# Altium project BSM-3_next_generation.PrjPcb
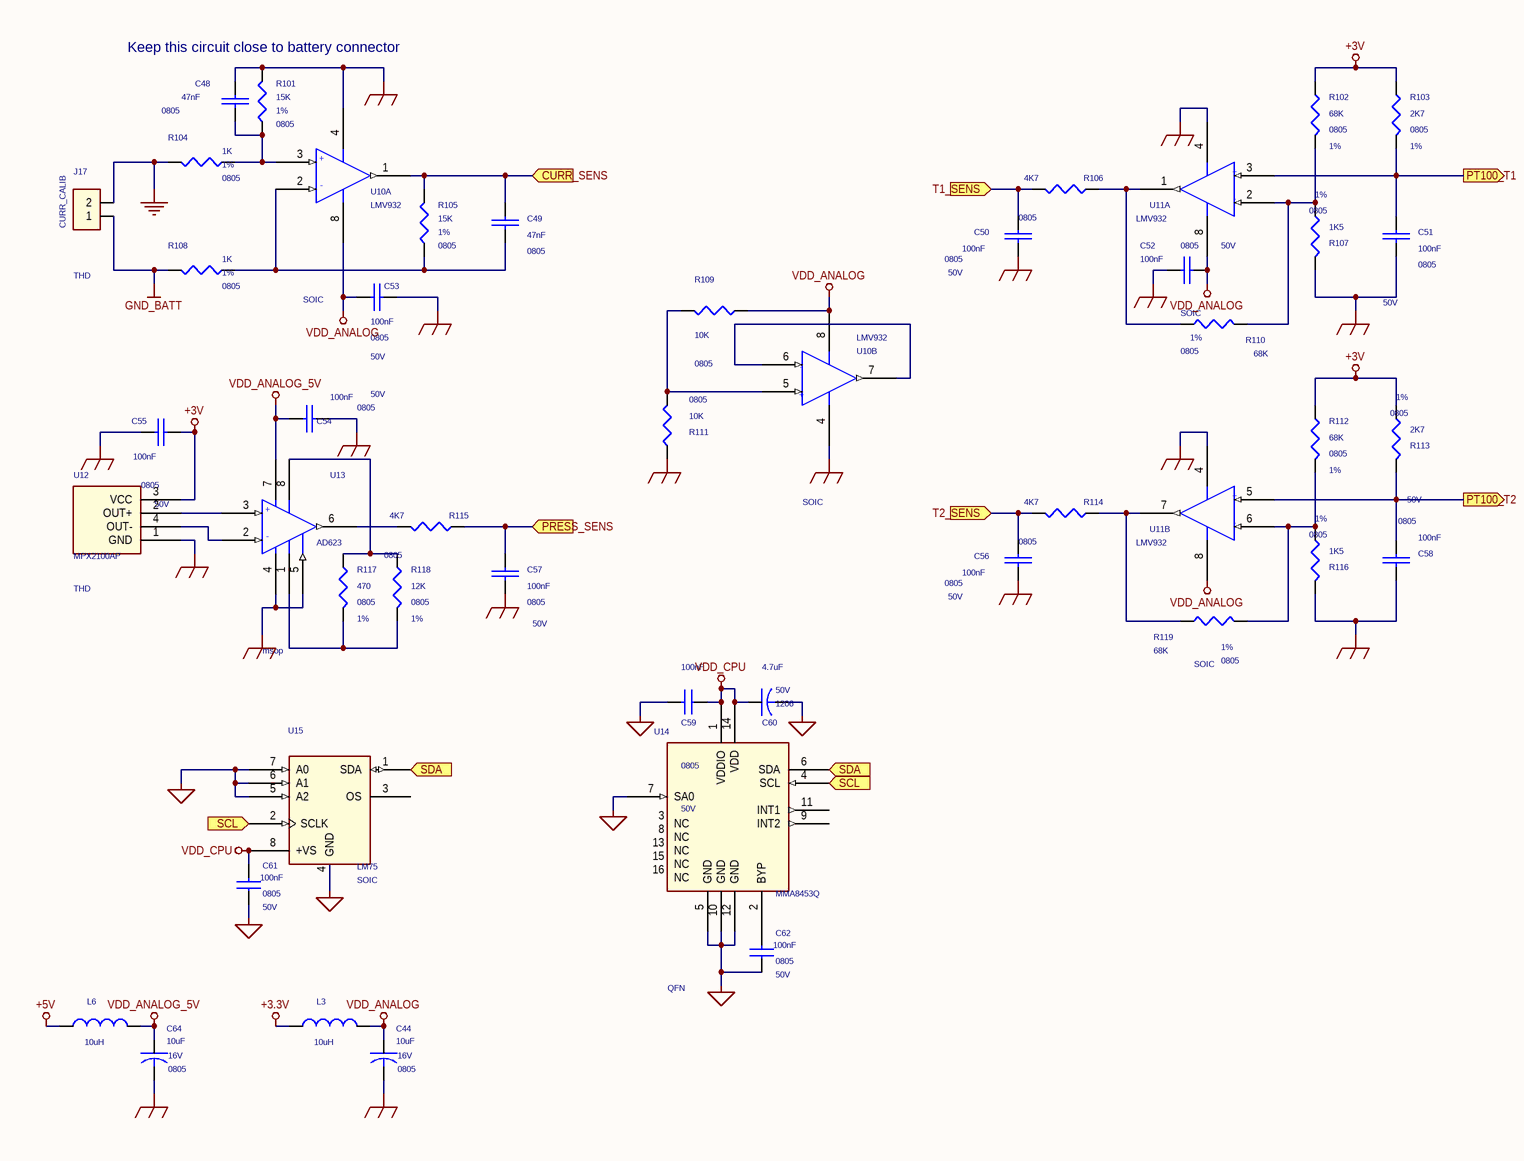
[diagram p0: Sensors.SchDoc]
4 sheets, 242 parts. Net scope: flat (ports and power ports of the same name join across sheets).
Sheets:
  Sensors.SchDoc
  Power Supply.SchDoc
  CPU.SchDoc
  Connectors.SchDoc

## Sheet Sensors.SchDoc
size 420 x 297 mm; Organization: Develer s.r.l.; Address1: via Mugellese 1/A; Address2: 50019 Campi Bisenzio; Address3: Firenze; Address4: ITALY; Revision: A; SheetNumber: 1; SheetTotal: 1

### Parts
C44  10uF  voltage: 16V  case: 0805  [SM/C_0805]
C48  47nF  case: 0805  [SM/C_0805]
C49  47nF  case: 0805  [SM/C_0805]
C50  100nF  voltage: 50V  case: 0805  [SM/C_0805]
C51  100nF  voltage: 50V  case: 0805  [SM/C_0805]
C52  100nF  voltage: 50V  case: 0805  [SM/C_0805]
C53  100nF  voltage: 50V  case: 0805  [SM/C_0805]
C54  100nF  voltage: 50V  case: 0805  [SM/C_0805]
C55  100nF  voltage: 50V  case: 0805  [SM/C_0805]
C56  100nF  voltage: 50V  case: 0805  [SM/C_0805]
C57  100nF  voltage: 50V  case: 0805  [SM/C_0805]
C58  100nF  voltage: 50V  case: 0805  [SM/C_0805]
C59  100nF  case: 0805  voltage: 50V  [SM/C_0805]
C60  4.7uF  case: 1206  voltage: 50V  [SM/C_1206]
C61  100nF  voltage: 50V  case: 0805  [SM/C_0805]
C62  100nF  voltage: 50V  case: 0805  [SM/C_0805]
C64  10uF  case: 0805  voltage: 16V  [SM/C_0805]
J17  CURR_CALIB  case: THD  [BLKCON.100/VH/TM1SQ/W.100/2]
L3  10uH  [SM/L_1210]
L6  10uH  [SM/L_1210]
R101  15K  case: 0805  1st: 1%  [SM/R_0805]
R102  68K  case: 0805  1st: 1%  [SM/R_0805]
R103  2K7  case: 0805  1st: 1%  [SM/R_0805]
R104  1K  case: 0805  1st: 1%  [SM/R_0805]
R105  15K  case: 0805  1st: 1%  [SM/R_0805]
R106  4K7  case: 0805  [SM/R_0805]
R107  1K5  case: 0805  1st: 1%  [SM/R_0805]
R108  1K  case: 0805  1st: 1%  [SM/R_0805]
R109  10K  case: 0805  [SM/R_0805]
R110  68K  case: 0805  1st: 1%  [SM/R_0805]
R111  10K  case: 0805  [SM/R_0805]
R112  68K  case: 0805  1st: 1%  [SM/R_0805]
R113  2K7  case: 0805  1st: 1%  [SM/R_0805]
R114  4K7  case: 0805  [SM/R_0805]
R115  4K7  case: 0805  [SM/R_0805]
R116  1K5  case: 0805  1st: 1%  [SM/R_0805]
R117  470  case: 0805  1st: 1%  [SM/R_0805]
R118  12K  case: 0805  1st: 1%  [SM/R_0805]
R119  68K  case: 0805  1st: 1%  [SM/R_0805]
U10  LMV932  case: SOIC  [SOG.050/8/WG.244/L.175]  (parts A,B of 2)
U11  LMV932  case: SOIC  [SOG.050/8/WG.244/L.175]  (parts A,B of 2)
U12  MPX2100AP  case: THD  [TO/MPX/4]
U13  AD623  case: msop  [TSSOP/0.65/8]
U14  MMA8453Q  case: QFN  [QNF/16]
U15  LM75  case: SOIC  [SOG.050/8/WG.244/L.200]

### Ports
CURR_SENS (in), PRESS_SENS (in), PT100_T1 (out), PT100_T2 (out), SCL (out), SDA (out), T1_SENS (in), T2_SENS (in)

### Nets
+3.3V: L3.2
+3V: C55.1 R102.1 R103.1 R112.1 R113.2 U12.3(VCC)
+5V: L6.2
GND: C59.2 C60.2 C61.1 C62.1 J17.2 R104.2 U14.5(GND) U14.7(SA0) U14.10(GND) U14.12(GND) U15.4(GND) U15.5(A2) U15.6(A1) U15.7(A0)  [also labelled GND_DIGITAL]
GND_ANALOG: C44.2 C48.2 C50.1 C51.1 C52.2 C53.2 C54.1 C55.2 C56.1 C57.1 C58.2 C64.2 R101.2 R107.1 R111.1 R116.1 U10.4(-VCC) U11.4(-VCC) U12.1(GND) U13.4(-VCC) U13.5(REF)
GND_BATT: J17.1 R108.2
VDD_ANALOG: C44.1 C52.1 C53.1 L3.1 R109.2 U10.8(+VCC) U11.8(+VCC)
VDD_ANALOG_5V: C54.2 C64.1 L6.1 U13.7(+VCC)
VDD_CPU: C59.1 C60.1 C61.2 U14.1(VDDIO) U14.14(VDD) U15.8(+VS)  [project net 18]
NetC48_1: C48.1 R101.1 R104.1 U10.3(+VIN)
NetC49_1: C49.1 R105.1 R108.1 U10.2(-VIN)
NetC49_2: C49.2 R105.2 U10.1(OUTPUT) ; port CURR_SENS
NetC50_2: C50.2 R106.1 ; port T1_SENS
NetC51_2: C51.2 R103.2 U11.3(+VIN) ; port PT100_T1
NetC56_2: C56.2 R114.1 ; port T2_SENS
NetC57_2: C57.2 R115.2 ; port PRESS_SENS
NetC58_1: C58.1 R113.1 U11.5(+VIN) ; port PT100_T2
NetC62_2: C62.2 U14.2(BYP)
NetJ15_11: U14.4(SCL) U15.2(SCLK) ; port SCL
NetJ15_13: U14.6(SDA) U15.1(SDA) ; port SDA
NetR102_2: R102.2 R107.2 R110.2 U11.2(-VIN)
NetR106_2: R106.2 R110.1 U11.1(OUTPUT)
NetR109_1: R109.1 R111.2 U10.5(+VIN)
NetR112_2: R112.2 R116.2 R119.1 U11.6(-VIN)
NetR114_2: R114.2 R119.2 U11.7(OUTPUT)
NetR115_1: R115.1 U13.6(OUT)
NetR117_1: R117.1 R118.1 U13.8(G10/100)
NetR117_2: R117.2 R118.2 U13.1(G10/100)
NetU10_6: U10.6(-VIN) U10.7(OUTPUT)
NetU12_2: U12.2(OUT+) U13.3(+IN)
NetU12_4: U12.4(OUT-) U13.2(-IN)

Not connected (* = marked no-connect by the designer): U14 3(NC) 8(NC) 9(INT2) 11(INT1) 13(NC) 15(NC) 16(NC); U15 3(OS)

### Notes on the sheet
- Keep this circuit close to battery connector
- Title:
- Size:
- Rev:
- A3
- Author:
- Approved:
- File:
- Date:
- Time:
- Sheet
- of
- (in symbol AD621/SO) +; -
- (in symbol LMV358/SO, part A) +; -
- (in symbol LMV358/SO, part B) +; -

### Library data of the parts
C44 C64 = C: COMPGROUP: 3
C48 C49 = C_Dup2: voltage: 50V; COMPGROUP: 4
C50-C58 = C_Dup2: COMPGROUP: 4
C59 C61 C62 = CAP NP: COMPGROUP: 4
C60 = C_0: COMPGROUP: 4
J17 = CON2: COMPGROUP: 4
L3 L6 = INDUCTOR: COMPGROUP: 3; case: 1210
R101-R105 R108 R112 R117-R119 = R_0: COMPGROUP: 4; 2nd: 100ppm
R106 R109 R114 = R_0: 1st: 1%; COMPGROUP: 4; 2nd: 100ppm
R107 R110 R113 R116 = R_0: 2nd: 100ppm; COMPGROUP: 4
R111 R115 = R_0: 1st: 1%; 2nd: 100ppm; COMPGROUP: 4
U10 U11 = LMV358/SO: COMPGROUP: 4
U12 = MPX2100: COMPGROUP: 4
U13 = AD621/SO: COMPGROUP: 4
U14 = MMA8453Q: COMPGROUP: 4
U15 = LM75/SO: COMPGROUP: 4

## Sheet Power Supply.SchDoc
size 420 x 297 mm; Organization: Develer s.r.l.; Address1: via Mugellese 1/A; Address2: 50019 Campi Bisenzio; Address3: Firenze; Address4: ITALY; Revision: A; SheetNumber: 1; SheetTotal: 1
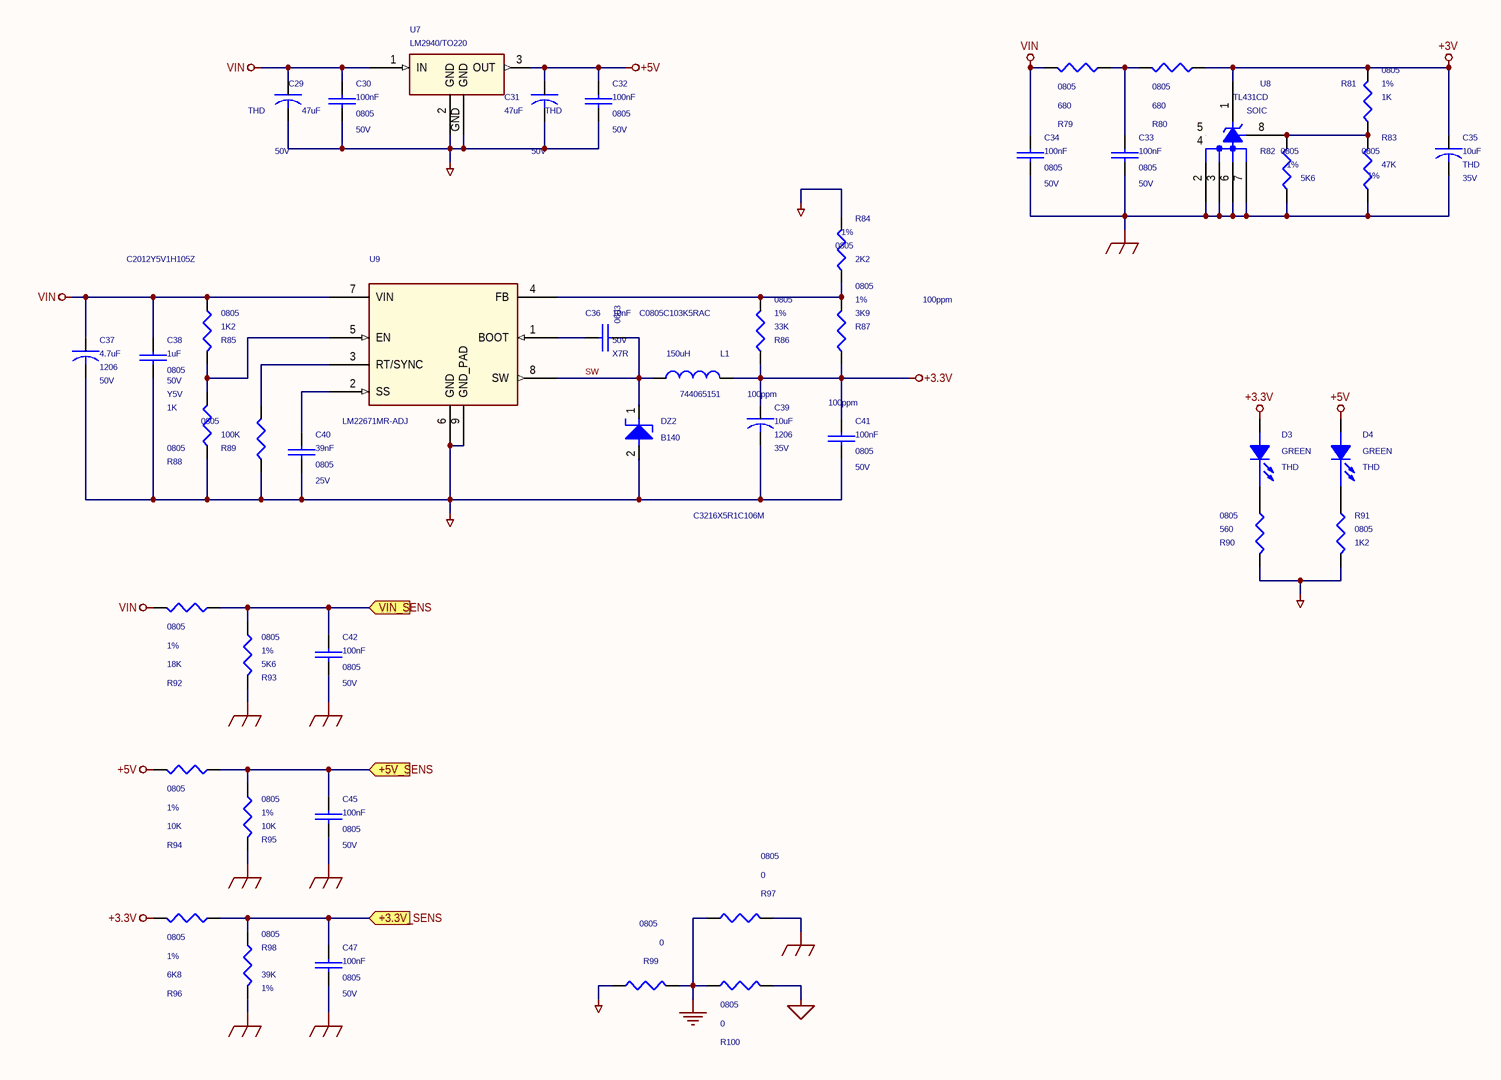
[diagram p1: Power Supply.SchDoc]

### Parts
C29  47uF  voltage: 50V  case: THD  [CPCYL1/D.250/LS.125/.031]
C30  100nF  voltage: 50V  case: 0805  [SM/C_0805]
C31  47uF  case: THD  voltage: 50V  [CPCYL1/D.250/LS.125/.031]
C32  100nF  voltage: 50V  case: 0805  [SM/C_0805]
C33  100nF  case: 0805  voltage: 50V  [SM/C_0805]
C34  100nF  case: 0805  voltage: 50V  [SM/C_0805]
C35  10uF  case: THD  voltage: 35V  [CPCYL1/D.200/LS.100/.031]
C36  10nF  case: 0603  voltage: 50V  2nd: C0805C103K5RAC  1st: X7R  [SM/C_0603]
C37  4.7uF  case: 1206  voltage: 50V  [SM/C_1206]
C38  1uF  case: 0805  voltage: 50V  2nd: C2012Y5V1H105Z  1st: Y5V  [SM/C_0805]
C39  10uF  case: 1206  voltage: 35V  2nd: C3216X5R1C106M  [SM/L_1206]
C40  39nF  voltage: 25V  case: 0805  [SM/C_0805]
C41  100nF  voltage: 50V  case: 0805  [SM/C_0805]
C42  100nF  voltage: 50V  case: 0805  [SM/C_0805]
C45  100nF  voltage: 50V  case: 0805  [SM/C_0805]
C47  100nF  voltage: 50V  case: 0805  [SM/C_0805]
D3  GREEN  case: THD  [LED/TM/R5]
D4  GREEN  case: THD  [LED/TM/R5]
DZ2  B140  [SM/DO214AC_12]
L1  150uH  1st: 744065151  [SMT/L_10X10]
R79  680  case: 0805  [SM/R_0805]
R80  680  case: 0805  [SM/R_0805]
R81  1K  case: 0805  1st: 1%  [SM/R_0805]
R82  5K6  case: 0805  1st: 1%  [SM/R_0805]
R83  47K  case: 0805  1st: 1%  [SM/R_0805]
R84  2K2  case: 0805  1st: 1%  2nd: 100ppm  [SM/R_0805]
R85  1K2  case: 0805  [SM/R_0805]
R86  33K  case: 0805  1st: 1%  2nd: 100ppm  [SM/R_0805]
R87  3K9  case: 0805  1st: 1%  2nd: 100ppm  [SM/R_0805]
R88  1K  case: 0805  [SM/R_0805]
R89  100K  case: 0805  [SM/R_0805]
R90  560  case: 0805  [SM/R_0805]
R91  1K2  case: 0805  [SM/R_0805]
R92  18K  case: 0805  1st: 1%  [SM/R_0805]
R93  5K6  case: 0805  1st: 1%  [SM/R_0805]
R94  10K  case: 0805  1st: 1%  [SM/R_0805]
R95  10K  case: 0805  1st: 1%  [SM/R_0805]
R96  6K8  case: 0805  1st: 1%  [SM/R_0805]
R97  0  case: 0805  [SM/SHORT_0805]
R98  39K  case: 0805  1st: 1%  [SM/R_0805]
R99  0  case: 0805  [SM/SHORT_0805]
R100  0  case: 0805  [SM/SHORT_0805]
U7  LM2940/TO220  [TO/TO220/3]
U8  TL431CD  case: SOIC  [SOG.050/8/WG.244/L.200]
U9  LM22671MR-ADJ  [PSOP/8]

### Ports
+3.3V_SENS (in), +5V_SENS (in), VIN_SENS (in)

### Nets
+3.3V: C39.1 C41.1 D3.1(ANODE) L1.2 R86.1 R87.1 R96.2
+3V: C35.1 R80.1 R81.2 U8.1(K)
+5V: C31.1 C32.1 D4.1(ANODE) R94.2 U7.3(OUT)
GND: C29.2 C30.2 C31.2 C32.2 C37.2 C38.2 C39.2 C40.2 C41.2 DZ2.2 R84.1 R88.1 R89.2 R90.2 R91.2 R97.2 R99.1 R99.2 R100.1 R100.2 U7.2(GND) U7.GND U9.6(GND) U9.9(GND_PAD)  [also labelled GND_DIGITAL, GND_POWER]
GND_ANALOG: C33.2 C34.2 C35.2 C42.2 C45.2 C47.2 R82.2 R83.2 R93.2 R95.2 R97.1 R98.2 U8.2(A) U8.3(A) U8.6(A) U8.7(A)
VIN: C29.1 C30.1 C34.1 C37.1 C38.1 R79.2 R85.1 R92.2 U7.1(IN) U9.7(VIN)
SW: C36.2 DZ2.1 L1.1 U9.8(SW)
NetC33_1: C33.1 R79.1 R80.2
NetC36_1: C36.1 U9.1(BOOT)
NetC40_1: C40.1 U9.2(SS)
NetC42_1: C42.1 R92.1 R93.1 ; port VIN_SENS
NetC45_1: C45.1 R94.1 R95.1 ; port +5V_SENS
NetC47_1: C47.1 R96.1 R98.1 ; port +3.3V_SENS
NetD3_2: D3.2(CATHODE) R90.1
NetD4_2: D4.2(CATHODE) R91.1
NetR81_1: R81.1 R82.1 R83.1 U8.8(REF)
NetR84_2: R84.2 R86.2 R87.2 U9.4(FB)
NetR85_2: R85.2 R88.2 U9.5(EN)
NetR89_1: R89.1 U9.3(RT/SYNC)

Not connected (* = marked no-connect by the designer): U8 4(NC) 5(NC)

### Notes on the sheet
- Title:
- Size:
- Rev:
- A3
- Author:
- Approved:
- File:
- Date:
- Time:
- Sheet
- of

### Library data of the parts
C29 C31 = C_Dup3: COMPGROUP: 3
C30 C32 C40-C42 C45 C47 = C_Dup2: COMPGROUP: 3
C33 C34 C36 C38 = C_Dup1: COMPGROUP: 3
C35 C37 C39 = C_0: COMPGROUP: 3
D3 D4 = LED: COMPGROUP: 3
DZ2 = ZENER_0: COMPGROUP: 3; case: SMB
L1 = L1: COMPGROUP: 3; case: SMD
R79 R80 = R_0: 1st: 5%; COMPGROUP: 3
R81-R83 R92-R96 R98 = R_0: COMPGROUP: 3; 2nd: 100ppm
R84 R86 R87 = R_0: COMPGROUP: 3
R85 R88-R91 = R_Dup1: 1st: 5%; COMPGROUP: 3
R97 = R: 1st: 5%; COMPGROUP: 3
R99 R100 = R: COMPGROUP: 3; 1st: 5%
U7 = LM2940/TO220_1: COMPGROUP: 3; case: TO220
U8 = TL431/SO_0: COMPGROUP: 3
U9 = LM22671MR-ADJ_0: COMPGROUP: 3; case: PSOP

## Sheet CPU.SchDoc
size 420 x 297 mm; Organization: Develer s.r.l.; Address1: via Mugellese 1/A; Address2: 50019 Campi Bisenzio; Address3: Firenze; Address4: ITALY; Revision: A; SheetNumber: 1; SheetTotal: 1
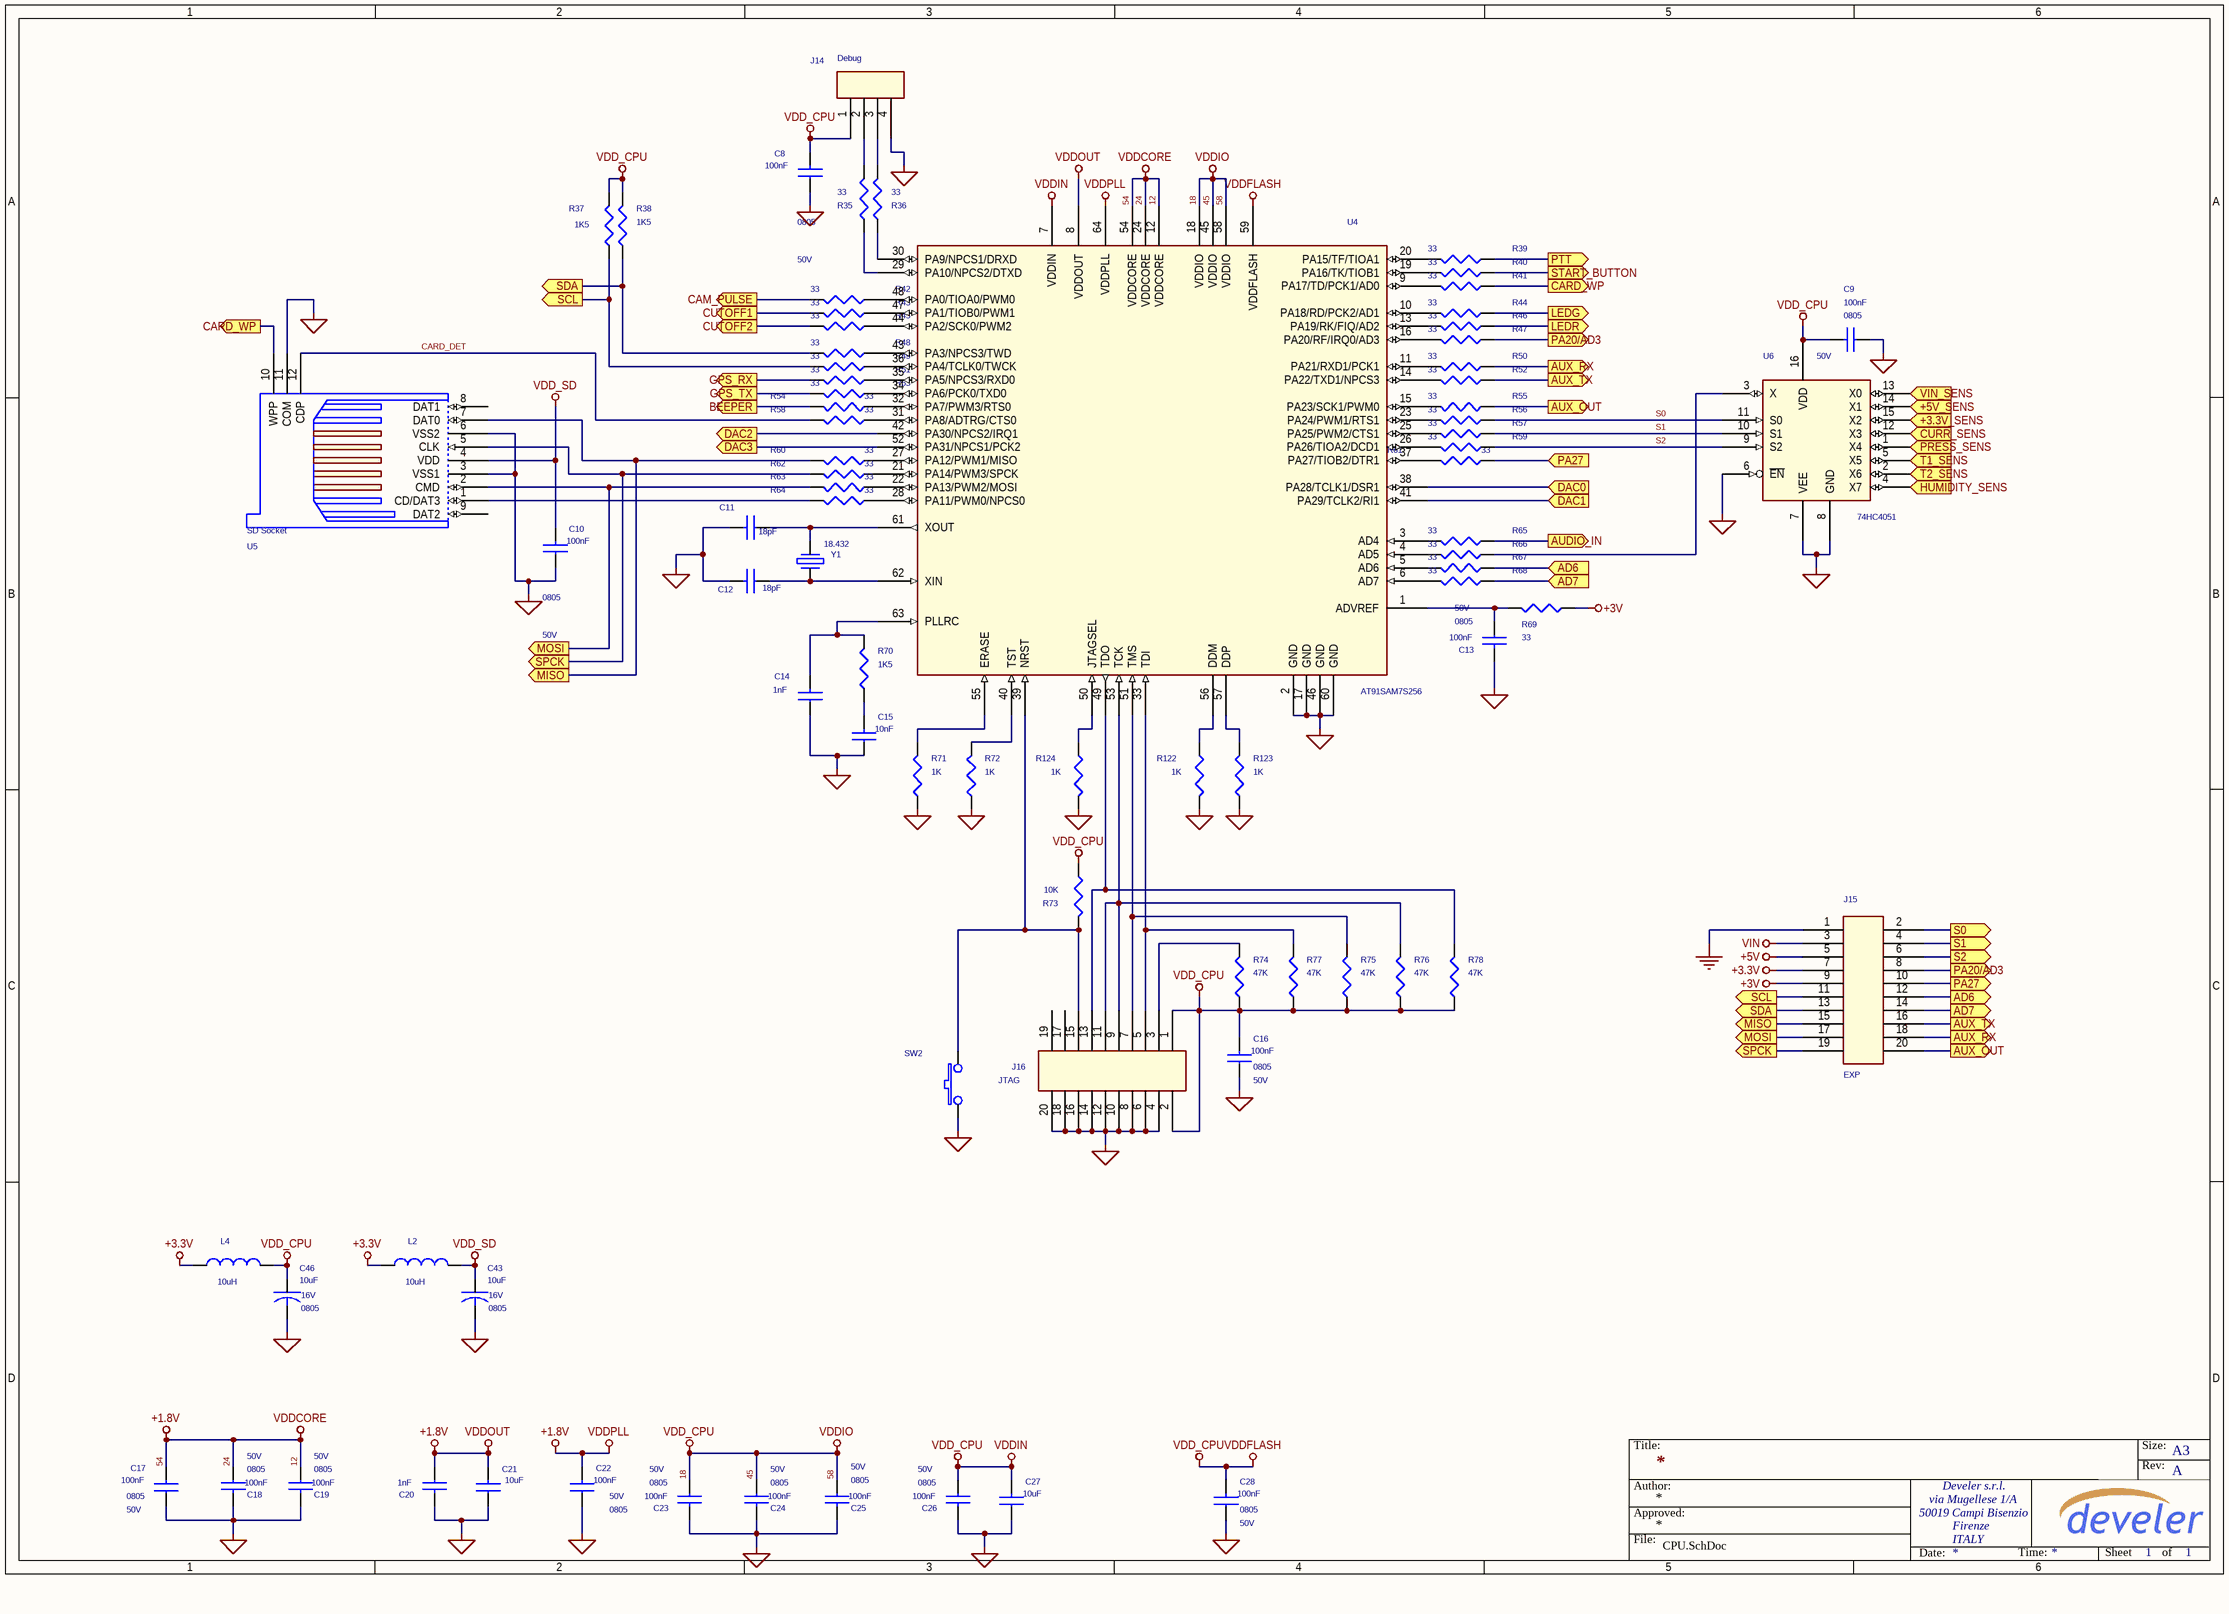
[diagram p2: CPU.SchDoc]

### Parts
C8  100nF  case: 0805  voltage: 50V  [SM/C_0805]
C9  100nF  case: 0805  voltage: 50V  [SM/C_0805]
C10  100nF  case: 0805  voltage: 50V  [SM/C_0805]
C11  18pF  [SM/C_0805]
C12  18pF  [SM/C_0805]
C13  100nF  voltage: 50V  case: 0805  [SM/C_0805]
C14  1nF  [SM/C_0805]
C15  10nF  [SM/C_0805]
C16  100nF  voltage: 50V  case: 0805  [SM/C_0805]
C17  100nF  voltage: 50V  case: 0805  [SM/C_0805]
C18  100nF  case: 0805  voltage: 50V  [SM/C_0805]
C19  100nF  case: 0805  voltage: 50V  [SM/C_0805]
C20  1nF  [SM/C_0805]
C21  10uF  [SM/C_0805]
C22  100nF  case: 0805  voltage: 50V  [SM/C_0805]
C23  100nF  voltage: 50V  case: 0805  [SM/C_0805]
C24  100nF  case: 0805  voltage: 50V  [SM/C_0805]
C25  100nF  case: 0805  voltage: 50V  [SM/C_0805]
C26  100nF  case: 0805  voltage: 50V  [SM/C_0805]
C27  10uF  [SM/C_0805]
C28  100nF  voltage: 50V  case: 0805  [SM/C_0805]
C43  10uF  case: 0805  voltage: 16V  [SM/C_0805]
C46  10uF  case: 0805  voltage: 16V  [SM/C_0805]
J14  Debug  [BLKCON.100/VH/TM1SQ/W.100/4]
J15  EXP  [BLKCON.100/VH/TM2OE/W.200/20]
J16  JTAG  [BLKCON.100/VH/TM2OE/W.200/20]
L2  10uH  [SM/L_1210]
L4  10uH  [SM/L_1210]
R35  33  [SM/R_0805]
R36  33  [SM/R_0805]
R37  1K5  [SM/R_0805]
R38  1K5  [SM/R_0805]
R39  33  [SM/R_0805]
R40  33  [SM/R_0805]
R41  33  [SM/R_0805]
R42  33  [SM/R_0805]
R43  33  [SM/R_0805]
R44  33  [SM/R_0805]
R45  33  [SM/R_0805]
R46  33  [SM/R_0805]
R47  33  [SM/R_0805]
R48  33  [SM/R_0805]
R49  33  [SM/R_0805]
R50  33  [SM/R_0805]
R51  33  [SM/R_0805]
R52  33  [SM/R_0805]
R53  33  [SM/R_0805]
R54  33  [SM/R_0805]
R55  33  [SM/R_0805]
R56  33  [SM/R_0805]
R57  33  [SM/R_0805]
R58  33  [SM/R_0805]
R59  33  [SM/R_0805]
R60  33  [SM/R_0805]
R61  33  [SM/R_0805]
R62  33  [SM/R_0805]
R63  33  [SM/R_0805]
R64  33  [SM/R_0805]
R65  33  [SM/R_0805]
R66  33  [SM/R_0805]
R67  33  [SM/R_0805]
R68  33  [SM/R_0805]
R69  33  [SM/R_0805]
R70  1K5  [SM/R_0805]
R71  1K  [SM/R_0805]
R72  1K  [SM/R_0805]
R73  10K  [SM/R_0805]
R74  47K  [SM/R_0805]
R75  47K  [SM/R_0805]
R76  47K  [SM/R_0805]
R77  47K  [SM/R_0805]
R78  47K  [SM/R_0805]
R122  1K  [SM/R_0805]
R123  1K  [SM/R_0805]
R124  1K  [SM/R_0805]
SW2  RESET  [SWITCH/KSJ]  (value not drawn)
U4  AT91SAM7S256  [QUAD.50M/64/WG12.00]
U5  SD Socket  [CARD_SOCKET]
U6  74HC4051  [SOG.050/16/WG.244/L.375]
Y1  18.432  [CRYSTAL/HC49UP]

### Ports
+3.3V_SENS (out), +5V_SENS (out), AD6 (in), AD6 (out), AD7 (in), AD7 (out), AUDIO_IN (out), AUX_OUT (out), AUX_RX (out), AUX_TX (out), BEEPER (out), CAM_PULSE (out), CARD_WP (out), CURR_SENS (out), CUTOFF1 (out), CUTOFF2 (out), DAC0 (in), DAC1 (in), DAC2 (out), DAC3 (out), GPS_RX (out), GPS_TX (out), HUMIDITY_SENS (out), LEDG (out), LEDR (out), MISO (out), MOSI (out), PA20/AD3 (out), PA27 (in), PA27 (out), PRESS_SENS (out), PTT (out), S0 (out), S1 (out), S2 (out), SCL (out), SDA (out), SPCK (out), START_BUTTON (out), T1_SENS (out), T2_SENS (out), VIN_SENS (out)

### Nets
12: C17.2 C18.1 C19.1 C20.1 C21.2 C22.2 U4.8(VDDOUT) U4.12(VDDCORE) U4.24(VDDCORE) U4.54(VDDCORE) U4.64(VDDPLL)  [also labelled +1.8V, 24, 54, VDDCORE, VDDOUT, VDDPLL]
18: C8.2 C9.2 C16.2 C23.1 C24.1 C25.1 C26.1 C27.2 C28.2 C46.1 J14.1 J16.1 J16.2 L4.1 R37.1 R38.1 R73.1 R74.1 R75.1 R76.1 R77.1 R78.1 U4.7(VDDIN) U4.18(VDDIO) U4.45(VDDIO) U4.58(VDDIO) U4.59(VDDFLASH) U6.16(VDD)  [also labelled 45, 58, VDD_CPU, VDDFLASH, VDDIN, VDDIO]
+3.3V: J15.7 L2.2 L4.2
+3V: J15.9 R69.2
+5V: J15.5
GND: C8.1 C9.1 C10.1 C11.2 C12.2 C13.2 C14.1 C15.1 C16.1 C17.1 C18.2 C19.2 C20.2 C21.1 C22.1 C23.2 C24.2 C25.2 C26.2 C27.1 C28.1 C43.2 C46.2 J14.4 J15.1 J16.4 J16.6 J16.8 J16.10 J16.12 J16.14 J16.16 J16.18 J16.20 R71.1 R72.1 R122.1 R123.1 R124.1 SW2.1 U4.2(GND) U4.17(GND) U4.46(GND) U4.60(GND) U5.3(VSS1) U5.6(VSS2) U5.11(COM) U6.6(~{EN}) U6.7(VEE) U6.8(GND)  [also labelled GND_DIGITAL]
VDD_SD: C10.2 C43.1 L2.1 U5.4(VDD)
VIN: J15.3
CARD_DET: R58.2 U5.12(CDP)
S0: R56.2 U6.11(S0)
S1: R57.2 U6.10(S1)
S2: R59.2 U6.9(S2)
NetC2_2: R40.2 ; port START_BUTTON
NetC3_1: R65.2 ; port AUDIO_IN
NetC7_2: U6.4(X7) ; port HUMIDITY_SENS
NetC11_1: C11.1 U4.61(XOUT) Y1.1
NetC12_1: C12.1 U4.62(XIN) Y1.2
NetC13_1: C13.1 R69.1 U4.1(ADVREF)
NetC14_2: C14.2 R70.2 U4.63(PLLRC)
NetC15_2: C15.2 R70.1
NetC42_1: U6.13(X0) ; port VIN_SENS
NetC45_1: U6.14(X1) ; port +5V_SENS
NetC47_1: U6.15(X2) ; port +3.3V_SENS
NetC49_2: U6.12(X3) ; port CURR_SENS
NetC50_2: U6.5(X5) ; port T1_SENS
NetC56_2: U6.2(X6) ; port T2_SENS
NetC57_2: U6.1(X4) ; port PRESS_SENS
NetJ4_4: R53.1 ; port GPS_TX
NetJ4_5: R51.1 ; port GPS_RX
NetJ10_1: J15.16 R52.2 ; port AUX_TX
NetJ10_2: J15.18 R50.2 ; port AUX_RX
NetJ14_2: J14.2 R35.2
NetJ14_3: J14.3 R36.2
NetJ15_2: J15.2 ; port S0
NetJ15_4: J15.4 ; port S1
NetJ15_6: J15.6 ; port S2
NetJ15_8: J15.8 R47.2 ; port PA20/AD3
NetJ15_10: J15.10 R61.1 ; port PA27
NetJ15_11: J15.11 R37.2 R49.1 ; port SCL
NetJ15_12: J15.12 R67.2 ; port AD6
NetJ15_13: J15.13 R38.2 R48.1 ; port SDA
NetJ15_14: J15.14 R68.2 ; port AD7
NetJ15_15: J15.15 R60.2 U5.7(DAT0) ; port MISO
NetJ15_17: J15.17 R63.2 U5.2(CMD) ; port MOSI
NetJ15_19: J15.19 R62.2 U5.5(CLK) ; port SPCK
NetJ15_20: J15.20 R55.2 ; port AUX_OUT
NetJ16_3: J16.3 R74.2
NetJ16_5: J16.5 R77.2 U4.33(TDI)
NetJ16_7: J16.7 R75.2 U4.51(TMS)
NetJ16_9: J16.9 J16.11 R76.2 U4.53(TCK)
NetJ16_13: J16.13 R78.2 U4.49(TDO)
NetJ16_15: J16.15 R73.2 SW2.2 U4.39(NRST)
NetR9_1: R42.1 ; port CAM_PULSE
NetR15_1: R54.2 ; port BEEPER
NetR16_1: R43.1 ; port CUTOFF1
NetR17_1: R45.1 ; port CUTOFF2
NetR18_1: R39.2 ; port PTT
NetR24_1: U4.52(PA31/NPCS1/PCK2) ; port DAC3
NetR27_1: U4.42(PA30/NPCS2/IRQ1) ; port DAC2
NetR29_1: U4.41(PA29/TCLK2/RI1) ; port DAC1
NetR31_1: U4.38(PA28/TCLK1/DSR1) ; port DAC0
NetR35_1: R35.1 U4.29(PA10/NPCS2/DTXD)
NetR36_1: R36.1 U4.30(PA9/NPCS1/DRXD)
NetR39_1: R39.1 U4.20(PA15/TF/TIOA1)
NetR40_1: R40.1 U4.19(PA16/TK/TIOB1)
NetR41_1: R41.1 U4.9(PA17/TD/PCK1/AD0)
NetR41_2: R41.2 U5.10(WPP) ; port CARD_WP
NetR42_2: R42.2 U4.48(PA0/TIOA0/PWM0)
NetR43_2: R43.2 U4.47(PA1/TIOB0/PWM1)
NetR44_1: R44.1 U4.10(PA18/RD/PCK2/AD1)
NetR44_2: R44.2 ; port LEDG
NetR45_2: R45.2 U4.44(PA2/SCK0/PWM2)
NetR46_1: R46.1 U4.13(PA19/RK/FIQ/AD2)
NetR46_2: R46.2 ; port LEDR
NetR47_1: R47.1 U4.16(PA20/RF/IRQ0/AD3)
NetR48_2: R48.2 U4.43(PA3/NPCS3/TWD)
NetR49_2: R49.2 U4.36(PA4/TCLK0/TWCK)
NetR50_1: R50.1 U4.11(PA21/RXD1/PCK1)
NetR51_2: R51.2 U4.35(PA5/NPCS3/RXD0)
NetR52_1: R52.1 U4.14(PA22/TXD1/NPCS3)
NetR53_2: R53.2 U4.34(PA6/PCK0/TXD0)
NetR54_1: R54.1 U4.32(PA7/PWM3/RTS0)
NetR55_1: R55.1 U4.15(PA23/SCK1/PWM0)
NetR56_1: R56.1 U4.23(PA24/PWM1/RTS1)
NetR57_1: R57.1 U4.25(PA25/PWM2/CTS1)
NetR58_1: R58.1 U4.31(PA8/ADTRG/CTS0)
NetR59_1: R59.1 U4.26(PA26/TIOA2/DCD1)
NetR60_1: R60.1 U4.27(PA12/PWM1/MISO)
NetR61_2: R61.2 U4.37(PA27/TIOB2/DTR1)
NetR62_1: R62.1 U4.21(PA14/PWM3/SPCK)
NetR63_1: R63.1 U4.22(PA13/PWM2/MOSI)
NetR64_1: R64.1 U4.28(PA11/PWM0/NPCS0)
NetR64_2: R64.2 U5.1(CD/DAT3)
NetR65_1: R65.1 U4.3(AD4)
NetR66_1: R66.1 U4.4(AD5)
NetR66_2: R66.2 U6.3(X)
NetR67_1: R67.1 U4.5(AD6)
NetR68_1: R68.1 U4.6(AD7)
NetR71_2: R71.2 U4.55(ERASE)
NetR72_2: R72.2 U4.40(TST)
NetR122_2: R122.2 U4.56(DDM)
NetR123_2: R123.2 U4.57(DDP)
NetR124_2: R124.2 U4.50(JTAGSEL)

Not connected (* = marked no-connect by the designer): J16 17 19; U5 8(DAT1) 9(DAT2)

### Notes on the sheet
- Title:
- Size:
- Rev:
- A3
- Author:
- Approved:
- File:
- Date:
- Time:
- Sheet
- of

### Library data of the parts
C8-C10 C13 C16-C19 C22-C26 C28 = CAP NP: COMPGROUP: 2
C11 C12 C14 C15 = CAP NP: voltage: 16V; COMPGROUP: 2; case: 0805
C20 C21 C27 = CAP NP: COMPGROUP: 2; voltage: 16V; case: 0805
C43 C46 = C: COMPGROUP: 3
J14 = CON4: COMPGROUP: 2; case: THD
J15 J16 = CON20A: COMPGROUP: 2; case: THD
L2 L4 = INDUCTOR: COMPGROUP: 3; case: 1210
R35 R36 R38 R39 R41-R43 R45 R48 R49 R52 R53 R60-R64 R69 R71-R78 R122-R124 = R: 1st: 5%; COMPGROUP: 2; case: 0805
R37 R40 R44 R46 R47 R50 R51 R54-R59 R65-R68 R70 = R: COMPGROUP: 2; 1st: 5%; case: 0805
SW2 = SW_PB_SPST: COMPGROUP: 2; case: THD
U4 = AT91SAM7S 64pin_0: COMPGROUP: 2; case: LQFP
U5 = Card Socket_1: COMPGROUP: 2; case: SMD
U6 = 74HC4051: COMPGROUP: 2; case: soic
Y1 = QUARZO: COMPGROUP: 2; case: HP49

## Sheet Connectors.SchDoc
size 420 x 297 mm; Organization: Develer s.r.l.; Address1: via Mugellese 1/A; Address2: 50019 Campi Bisenzio; Address3: Firenze; Address4: ITALY; Revision: A; SheetNumber: 1; SheetTotal: 1
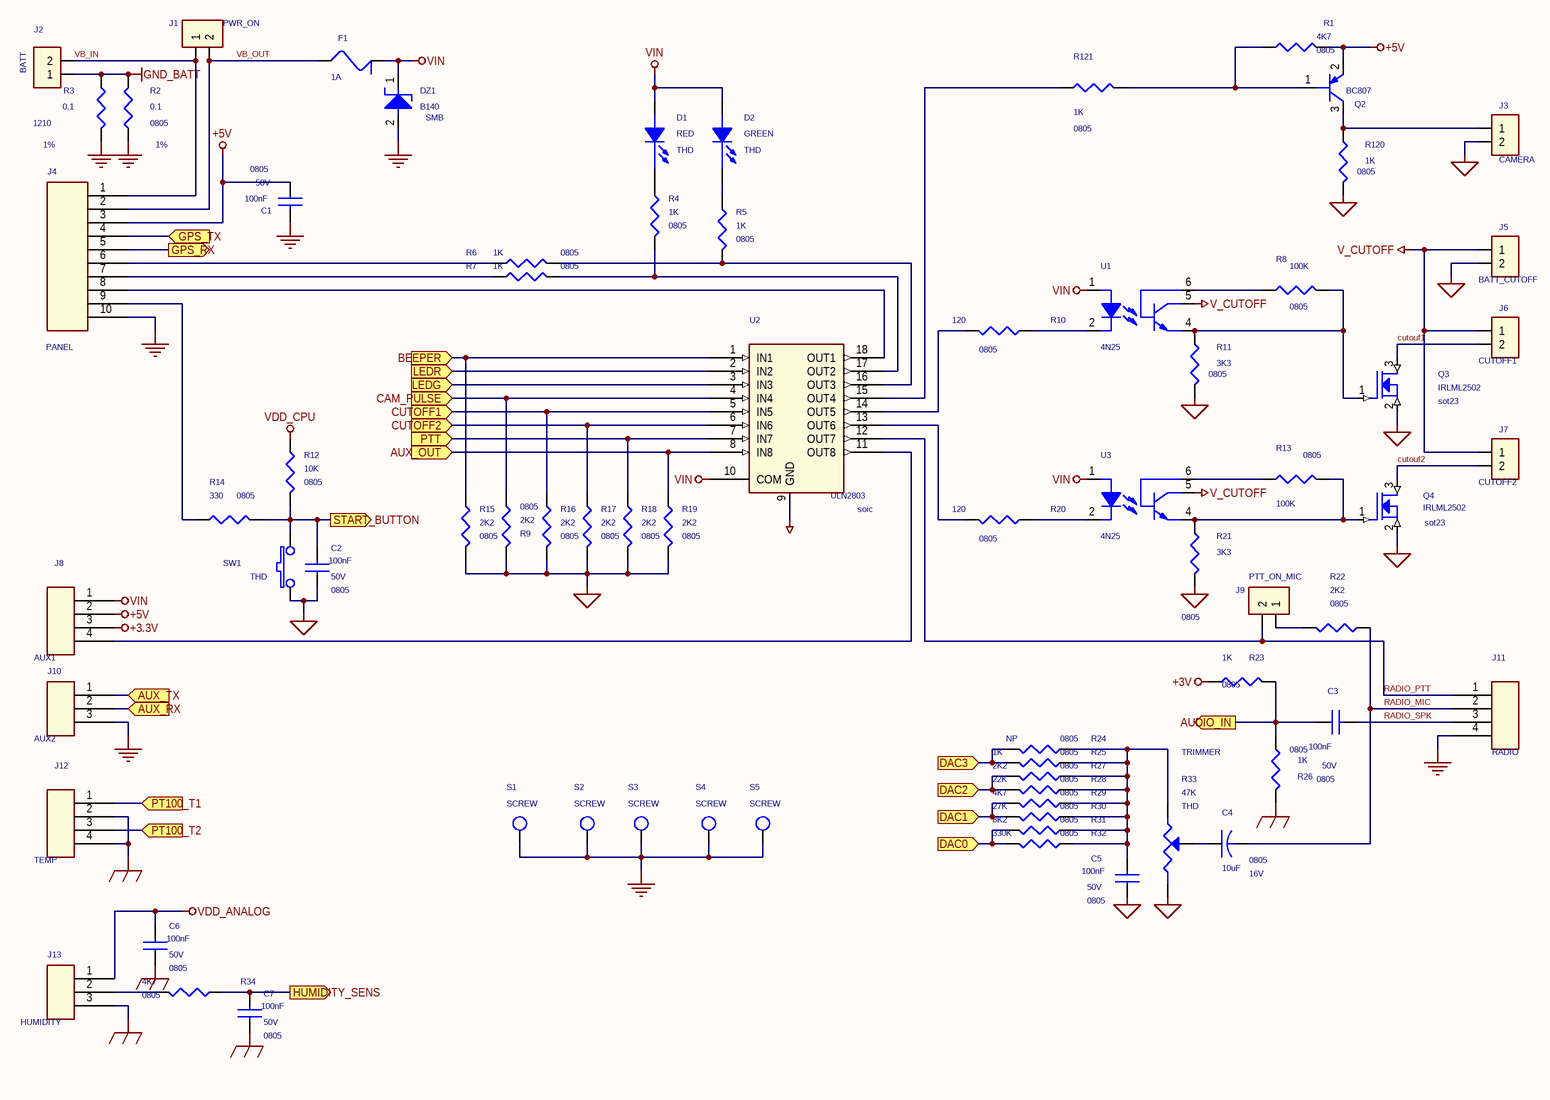
[diagram p3: Connectors.SchDoc]

### Parts
C1  100nF  case: 0805  voltage: 50V  [SM/C_0805]
C2  100nF  case: 0805  voltage: 50V  [SM/C_0805]
C3  100nF  voltage: 50V  case: 0805  [SM/C_0805]
C4  10uF  voltage: 16V  case: 0805  [SM/C_0805]
C5  100nF  case: 0805  voltage: 50V  [SM/C_0805]
C6  100nF  voltage: 50V  case: 0805  [SM/C_0805]
C7  100nF  voltage: 50V  case: 0805  [SM/C_0805]
D1  RED  case: THD  [LED/TM/R5]
D2  GREEN  case: THD  [LED/TM/R5]
DZ1  B140  case: SMB  [SM/DO214AC_12]
F1  1A  [TM/MF-R075]
J1  PWR_ON  [BLKCON.100/VH/TM1SQ/W.100/2]
J2  BATT  [TBLOCK_PCB/H/350/2]
J3  CAMERA  [TBLOCK_PCB/H/350/2]
J4  PANEL  [BLKCON.100/VH/TM2OE/W.200/10]
J5  BATT_CUTOFF  [TBLOCK_PCB/H/350/2]
J6  CUTOFF1  [TBLOCK_PCB/H/350/2]
J7  CUTOFF2  [TBLOCK_PCB/H/350/2]
J8  AUX1  [TBLOCK_PCB/H/350/4]
J9  PTT_ON_MIC  [BLKCON.100/VH/TM1SQ/W.100/2]
J10  AUX2  [TBLOCK_PCB/H/350/3]
J11  RADIO  [TBLOCK_PCB/H/350/4]
J12  TEMP  [TBLOCK_PCB/H/350/4]
J13  HUMIDITY  [TBLOCK_PCB/H/350/3]
Q2  BC807  [SM/SOT23_123]
Q3  IRLML2502  case: sot23  [SM/SOT23_123]
Q4  IRLML2502  case: sot23  [SM/SOT23_123]
R1  4K7  case: 0805  [SM/R_0805]
R2  0.1  1st: 1%  case: 0805  [SM/R_0805]
R3  0.1  1st: 1%  case: 1210  [SM/R_1210]
R4  1K  case: 0805  [SM/R_0805]
R5  1K  case: 0805  [SM/R_0805]
R6  1K  case: 0805  [SM/R_0805]
R7  1K  case: 0805  [SM/R_0805]
R8  100K  case: 0805  [SM/R_0805]
R9  2K2  case: 0805  [SM/R_0805]
R10  120  case: 0805  [SM/R_0805]
R11  3K3  case: 0805  [SM/R_0805]
R12  10K  case: 0805  [SM/R_0805]
R13  100K  case: 0805  [SM/R_0805]
R14  330  case: 0805  [SM/R_0805]
R15  2K2  case: 0805  [SM/R_0805]
R16  2K2  case: 0805  [SM/R_0805]
R17  2K2  case: 0805  [SM/R_0805]
R18  2K2  case: 0805  [SM/R_0805]
R19  2K2  case: 0805  [SM/R_0805]
R20  120  case: 0805  [SM/R_0805]
R21  3K3  case: 0805  [SM/R_0805]
R22  2K2  case: 0805  [SM/R_0805]
R23  1K  case: 0805  [SM/R_0805]
R24  NP  case: 0805  [SM/R_0805]
R25  1K  case: 0805  [SM/R_0805]
R26  1K  case: 0805  [SM/R_0805]
R27  2K2  case: 0805  [SM/R_0805]
R28  22K  case: 0805  [SM/R_0805]
R29  4K7  case: 0805  [SM/R_0805]
R30  27K  case: 0805  [SM/R_0805]
R31  8K2  case: 0805  [SM/R_0805]
R32  330K  case: 0805  [SM/R_0805]
R33  47K  case: THD  1st: TRIMMER  [VRES4]
R34  4K7  case: 0805  [SM/R_0805]
R120  1K  case: 0805  [SM/R_0805]
R121  1K  case: 0805  [SM/R_0805]
S1  SCREW  [SCREW/M3]
S2  SCREW  [SCREW/M3]
S3  SCREW  [SCREW/M3]
S4  SCREW  [SCREW/M3]
S5  SCREW  [SCREW/M3]
SW1  case: THD  [SWITCH/KSJ]  (hidden comment: START)
U1  4N25  [SMT/OPTO/6]
U2  ULN2803  case: soic  [SOJ.050/18/WB.400/L.450]
U3  4N25  [SMT/OPTO/6]

### Ports
AUDIO_IN (out), AUX_OUT (in), AUX_RX (in), AUX_TX (in), BEEPER (in), CAM_PULSE (in), CUTOFF1 (in), CUTOFF2 (in), DAC0 (in), DAC1 (in), DAC2 (in), DAC3 (in), GPS_RX (out), GPS_TX (in), HUMIDITY_SENS (out), LEDG (in), LEDR (in), PT100_T1 (in), PT100_T2 (in), PTT (in), START_BUTTON (out)

### Nets
+3.3V: J8.3
+3V: R23.2
+5V: C1.1 J4.3 J8.2 Q2.2(E) R1.2
GND: C1.2 C2.1 C5.1 DZ1.2 J3.2 J4.10 J10.3 J11.4 R2.1 R3.1 R9.2 R15.2 R16.2 R17.2 R18.2 R19.2 R33.3 R120.1 S1.1(TP) S2.1(TP) S3.1(TP) S4.1(TP) S5.1(TP) SW1.1 U2.9(GND)  [also labelled GND_DIGITAL, GND_POWER]
GND_ANALOG: C6.1 C7.1 J12.2 J12.4 J13.3 R26.2
GND_BATT: J2.1 R2.2 R3.2
GND_CUTOFF: J5.2 Q3.2(S) Q4.2(S) R11.1 R21.1
V_CUTOFF: J5.1 J6.1 J7.1 U1.5 U3.5
VDD_ANALOG: C6.2 J13.1
VDD_CPU: R12.1  [project net 18]
VIN: D1.1(ANODE) D2.1(ANODE) DZ1.1 F1.2 J8.1 U1.1 U2.10(COM) U3.1
cutouf1: J6.2 Q3.3(D)
cutouf2: J7.2 Q4.3(D)
RADIO_MIC: C4.2 J11.2 R22.2
RADIO_PTT: J9.2 J11.1 U2.12(OUT7)
RADIO_SPK: C3.2 J11.3
VB_IN: J1.1 J2.2 J4.1
VB_OUT: F1.1 J1.2 J4.2
NetC2_2: C2.2 R12.2 R14.2 SW1.2 ; port START_BUTTON
NetC3_1: C3.1 R23.1 R26.1 ; port AUDIO_IN
NetC4_1: C4.1 R33.2
NetC5_2: C5.2 R24.2 R25.2 R27.2 R28.2 R29.2 R30.2 R31.2 R32.2 R33.1
NetC7_2: C7.2 R34.2 ; port HUMIDITY_SENS
NetC51_2: J12.1 ; port PT100_T1
NetC58_1: J12.3 ; port PT100_T2
NetD1_2: D1.2(CATHODE) R4.1
NetD2_2: D2.2(CATHODE) R5.1
NetJ3_1: J3.1 Q2.3(C) R120.2
NetJ4_4: J4.4 ; port GPS_TX
NetJ4_5: J4.5 ; port GPS_RX
NetJ4_6: J4.6 R6.1
NetJ4_7: J4.7 R7.1
NetJ4_8: J4.8 U2.18(OUT1)
NetJ4_9: J4.9 R14.1
NetJ8_4: J8.4 U2.11(OUT8)
NetJ9_1: J9.1 R22.1
NetJ10_1: J10.1 ; port AUX_TX
NetJ10_2: J10.2 ; port AUX_RX
NetJ13_2: J13.2 R34.1
NetJ15_20: R19.1 U2.8(IN8) ; port AUX_OUT
NetQ2_1: Q2.1(B) R1.1 R121.1
NetQ3_1: Q3.1(G) R8.1 R11.2 U1.4
NetQ4_1: Q4.1(G) R13.1 R21.2 U3.4
NetR4_2: R4.2 R7.2 U2.17(OUT2)
NetR5_2: R5.2 R6.2 U2.16(OUT3)
NetR8_2: R8.2 U1.6
NetR9_1: R9.1 U2.4(IN4) ; port CAM_PULSE
NetR10_1: R10.1 U2.14(OUT5)
NetR10_2: R10.2 U1.2
NetR13_2: R13.2 U3.6
NetR15_1: R15.1 U2.1(IN1) ; port BEEPER
NetR16_1: R16.1 U2.5(IN5) ; port CUTOFF1
NetR17_1: R17.1 U2.6(IN6) ; port CUTOFF2
NetR18_1: R18.1 U2.7(IN7) ; port PTT
NetR20_1: R20.1 U2.13(OUT6)
NetR20_2: R20.2 U3.2
NetR24_1: R24.1 R25.1 ; port DAC3
NetR27_1: R27.1 R28.1 ; port DAC2
NetR29_1: R29.1 R30.1 ; port DAC1
NetR31_1: R31.1 R32.1 ; port DAC0
NetR44_2: U2.3(IN3) ; port LEDG
NetR46_2: U2.2(IN2) ; port LEDR
NetR121_2: R121.2 U2.15(OUT4)

### Notes on the sheet
- Title:
- Size:
- Rev:
- A3
- Author:
- Approved:
- File:
- Date:
- Time:
- Sheet
- of

### Library data of the parts
C1-C3 C5-C7 = CAP NP: COMPGROUP: 1
C4 = C: COMPGROUP: 1
D1 D2 = LED: COMPGROUP: 1
DZ1 = ZENER_0: COMPGROUP: 1
F1 = FUSE: COMPGROUP: 1; case: THD
J1 J9 = CON2: COMPGROUP: 1; 1st: PINSTRIP; case: THD
J2 J3 J5-J7 = CON2: COMPGROUP: 1
J4 = CON10: COMPGROUP: 1; case: THD
J8 J11 J12 = CON4: COMPGROUP: 1
J10 J13 = CON3: COMPGROUP: 1; case: THD
Q2 = BC807: COMPGROUP: 1
Q3 Q4 = MOSFET N_1: COMPGROUP: 1
R1 R8 R13 R20 R21 R24-R26 R28 R31 R32 R34 R120 R121 = R: COMPGROUP: 1; 1st: 5%
R2 R3 = R_Dup1: 2nd: 100ppm; COMPGROUP: 1
R4-R7 R12 R14 R16-R19 = R_Dup1: 1st: 5%; 2nd: 100ppm; COMPGROUP: 1
R9 R15 = R_Dup1: 1st: 5%; COMPGROUP: 1; 2nd: 100ppm
R10 R11 R22 R23 R27 R29 R30 = R: 1st: 5%; COMPGROUP: 1
R33 = RV: COMPGROUP: 1
S1-S5 = T POINT R
SW1 = SW_PB_SPST: COMPGROUP: 1
U1 U3 = 4N25: COMPGROUP: 1; case: soic
U2 = ULN2803: COMPGROUP: 1

## Nets that join several sheets
18: Sensors (6 pins), CPU (28 pins), Connectors (R12.1)
+3.3V: Sensors (L3.2), Power Supply (7 pins), CPU (J15.7 L2.2 L4.2), Connectors (J8.3)
+3V: Sensors (6 pins), Power Supply (C35.1 R80.1 R81.2 U8.1), CPU (J15.9 R69.2), Connectors (R23.2)
+5V: Sensors (L6.2), Power Supply (5 pins), CPU (J15.5), Connectors (5 pins)
GND: Sensors (14 pins), Power Supply (24 pins), CPU (50 pins), Connectors (25 pins)
GND_ANALOG: Sensors (21 pins), Power Supply (16 pins), Connectors (6 pins)
GND_BATT: Sensors (J17.1 R108.2), Connectors (J2.1 R2.2 R3.2)
VDD_ANALOG: Sensors (7 pins), Connectors (C6.2 J13.1)
VIN: Power Supply (10 pins), CPU (J15.3), Connectors (8 pins)
NetC2_2: CPU (R40.2), Connectors (C2.2 R12.2 R14.2 SW1.2)
NetC3_1: CPU (R65.2), Connectors (C3.1 R23.1 R26.1)
NetC7_2: CPU (U6.4), Connectors (C7.2 R34.2)
NetC42_1: Power Supply (C42.1 R92.1 R93.1), CPU (U6.13)
NetC45_1: Power Supply (C45.1 R94.1 R95.1), CPU (U6.14)
NetC47_1: Power Supply (C47.1 R96.1 R98.1), CPU (U6.15)
NetC49_2: Sensors (C49.2 R105.2 U10.1), CPU (U6.12)
NetC50_2: Sensors (C50.2 R106.1), CPU (U6.5)
NetC51_2: Sensors (C51.2 R103.2 U11.3), Connectors (J12.1)
NetC56_2: Sensors (C56.2 R114.1), CPU (U6.2)
NetC57_2: Sensors (C57.2 R115.2), CPU (U6.1)
NetC58_1: Sensors (C58.1 R113.1 U11.5), Connectors (J12.3)
NetJ4_4: CPU (R53.1), Connectors (J4.4)
NetJ4_5: CPU (R51.1), Connectors (J4.5)
NetJ10_1: CPU (J15.16 R52.2), Connectors (J10.1)
NetJ10_2: CPU (J15.18 R50.2), Connectors (J10.2)
NetJ15_11: Sensors (U14.4 U15.2), CPU (J15.11 R37.2 R49.1)
NetJ15_13: Sensors (U14.6 U15.1), CPU (J15.13 R38.2 R48.1)
NetJ15_20: CPU (J15.20 R55.2), Connectors (R19.1 U2.8)
NetR9_1: CPU (R42.1), Connectors (R9.1 U2.4)
NetR15_1: CPU (R54.2), Connectors (R15.1 U2.1)
NetR16_1: CPU (R43.1), Connectors (R16.1 U2.5)
NetR17_1: CPU (R45.1), Connectors (R17.1 U2.6)
NetR18_1: CPU (R39.2), Connectors (R18.1 U2.7)
NetR24_1: CPU (U4.52), Connectors (R24.1 R25.1)
NetR27_1: CPU (U4.42), Connectors (R27.1 R28.1)
NetR29_1: CPU (U4.41), Connectors (R29.1 R30.1)
NetR31_1: CPU (U4.38), Connectors (R31.1 R32.1)
NetR44_2: CPU (R44.2), Connectors (U2.3)
NetR46_2: CPU (R46.2), Connectors (U2.2)